# Altium project Autio_Mixer.PrjPcb
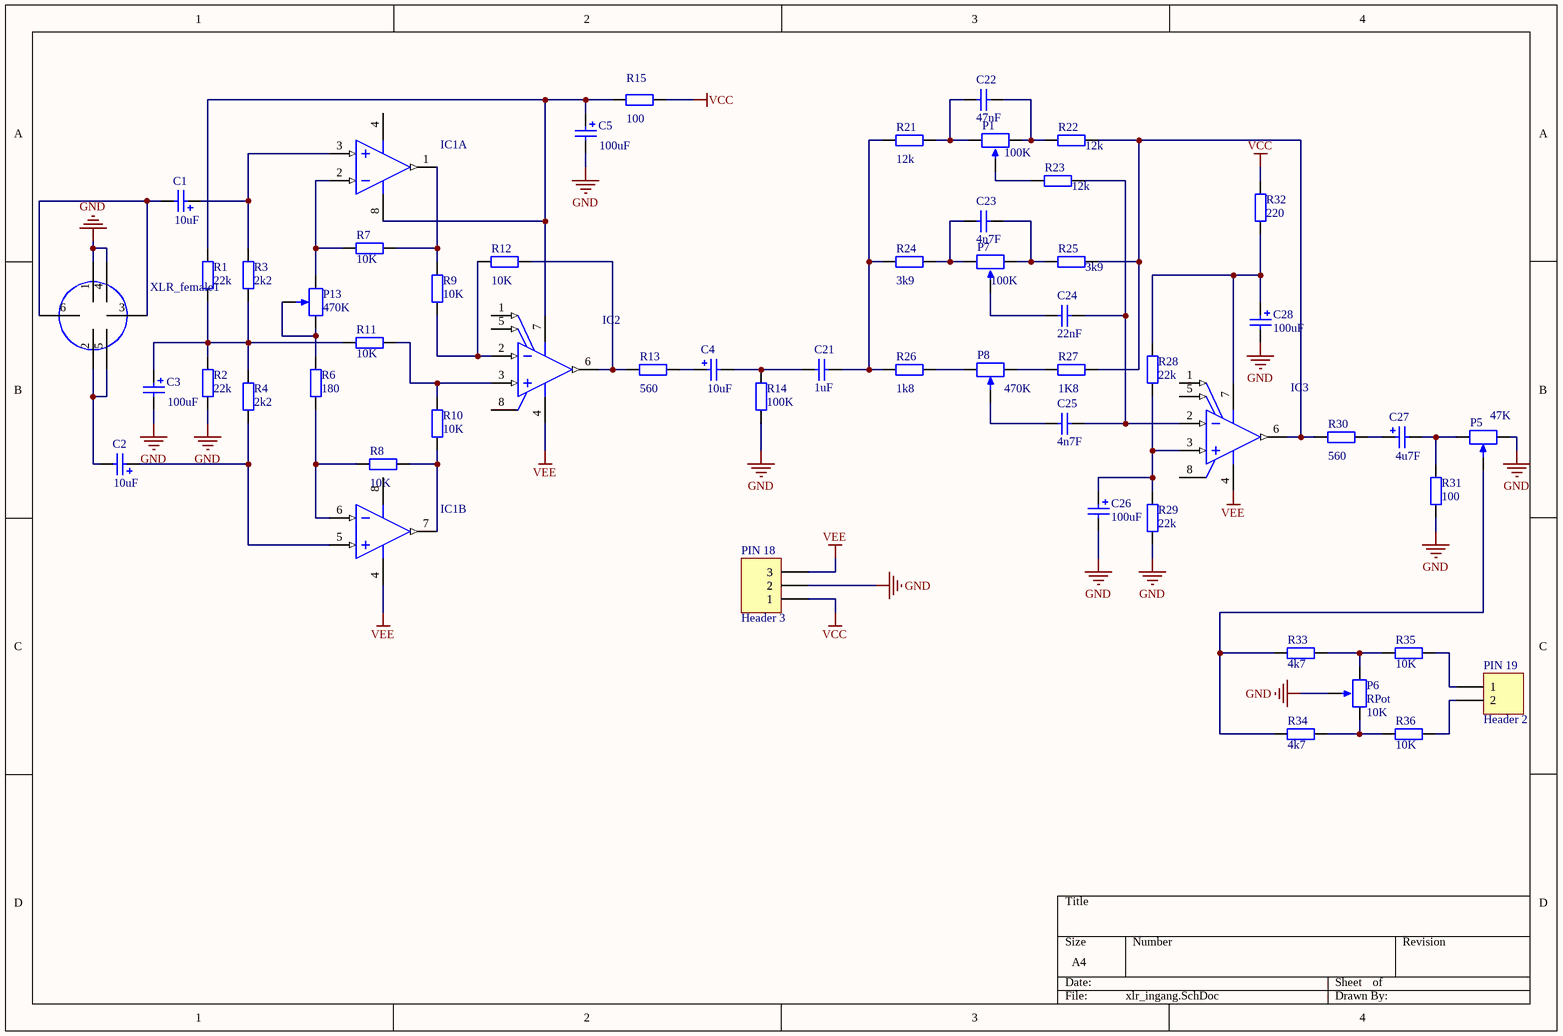
[diagram p0: xlr_ingang.SchDoc]
4 sheets, 242 parts. Net scope: flat (ports and power ports of the same name join across sheets).
Board files: power_sup.PcbDoc, summing_circuit.PcbDoc, cinch_stereo_ingang.PcbDoc, xlr_ingang.PcbDoc, circuit_everything.PcbDoc
Sheets:
  xlr_ingang.SchDoc
  cinch_stereo_ingang.SchDoc
  summing_circuit.SchDoc
  power_SUP.SchDoc

## Sheet xlr_ingang.SchDoc
size A4

### Parts
C1  value 10uF  [Capacitor 10uF]  (hidden comment: Cap Pol2)
C2  value 10uF  [Capacitor 10uF]  (hidden comment: Cap Pol2)
C3  value 100uF  [Capacitor 100uF]  (hidden comment: Cap Pol2)
C4  value 10uF  [Capacitor 10uF]  (hidden comment: Cap Pol2)
C5  value 100uF  [Capacitor 100uF]  (hidden comment: Cap Pol2)
C21  value 1uF  [Capacitor 1uF]  (hidden comment: Cap)
C22  value 47nF  [Capacitor 22nF, 47nF, 100nF]  (hidden comment: Cap)
C23  value 4n7F  [Capacitor 22nF, 47nF, 100nF]  (hidden comment: Cap)
C24  value 22nF  [Capacitor 22nF, 47nF, 100nF]  (hidden comment: Cap)
C25  value 4n7F  [Capacitor 22nF, 47nF, 100nF]  (hidden comment: Cap)
C26  value 100uF  [Capacitor 100uF]  (hidden comment: Cap Pol2)
C27  value 4u7F  [Capacitor 4u7F]  (hidden comment: Cap Pol2)
C28  value 100uF  [Capacitor 100uF]  (hidden comment: Cap Pol2)
IC1  LM833DR2G  [OPAMP_LM833]  (value not drawn)  (parts A,B of 2)
IC2  TL061CD  [OPAMP_TL061]  (value not drawn)
IC3  TL061CD  [OPAMP_TL061]  (value not drawn)
P1  value 100K  [header_3]  (hidden comment: RPot)
P5  value 47K  [header_3]  (hidden comment: RPot)
P6  RPot  value 10K  [header_3]
P7  value 100K  [header_3]  (hidden comment: RPot)
P8  value 470K  [header_3]  (hidden comment: RPot)
P13  value 470K  [header_3]  (hidden comment: RPot)
PIN_18  Header 3  [header_3]
PIN_19  Header 2  [header_2]
R1  value 22k  [C1206]  (hidden comment: Res2)
R2  value 22k  [C1206]  (hidden comment: Res2)
R3  value 2k2  [C1206]  (hidden comment: Res2)
R4  value 2k2  [C1206]  (hidden comment: Res2)
R6  value 180  [C1206]  (hidden comment: Res2)
R7  value 10K  [C1206]  (hidden comment: Res2)
R8  value 10K  [C1206]  (hidden comment: Res2)
R9  value 10K  [C1206]  (hidden comment: Res2)
R10  value 10K  [C1206]  (hidden comment: Res2)
R11  value 10K  [C1206]  (hidden comment: Res2)
R12  value 10K  [C1206]  (hidden comment: Res2)
R13  value 560  [C1206]  (hidden comment: Res2)
R14  value 100K  [C1206]  (hidden comment: Res2)
R15  value 100  [C1206]  (hidden comment: Res2)
R21  value 12k  [C1206]  (hidden comment: Res2)
R22  value 12k  [C1206]  (hidden comment: Res2)
R23  value 12k  [C1206]  (hidden comment: Res2)
R24  value 3k9  [C1206]  (hidden comment: Res2)
R25  value 3k9  [C1206]  (hidden comment: Res2)
R26  value 1k8  [C1206]  (hidden comment: Res2)
R27  value 1K8  [C1206]  (hidden comment: Res2)
R28  value 22k  [C1206]  (hidden comment: Res2)
R29  value 22k  [C1206]  (hidden comment: Res2)
R30  value 560  [C1206]  (hidden comment: Res2)
R31  value 100  [C1206]  (hidden comment: Res2)
R32  value 220  [C1206]  (hidden comment: Res2)
R33  value 4k7  [C1206]  (hidden comment: Res2)
R34  value 4k7  [C1206]  (hidden comment: Res2)
R35  value 10K  [C1206]  (hidden comment: Res2)
R36  value 10K  [C1206]  (hidden comment: Res2)
XLR_female1  XLR_female  [XLR_Femail_Neutrik_NCJ6FA-V]  (value not drawn)

### Nets
GND: C3.2 C5.2 C26.2 C28.2 P5.3(BOT) P6.2(TAP) PIN_18.1(2) R2.1 R14.1 R29.1 R31.1 XLR_female1.1(GND) XLR_female1.4(Sleeve_/_GND)
VCC: PIN_18.2(1) R15.2 R32.2
VEE: IC1.4(VEE) IC2.4(VCC-) IC3.4(VCC-) PIN_18.3
NetC1_1: C1.1 IC1.3(IN1+) R3.2
NetC1_2: C1.2 XLR_female1.3(negative) XLR_female1.6(Tip_/_pos)
NetC2_1: C2.1 IC1.5(IN2+) R4.1
NetC2_2: C2.2 XLR_female1.2(Pos) XLR_female1.5(Ring_/_neg)
NetC3_1: C3.1 R1.1 R2.2 R3.1 R4.2 R11.1
NetC4_1: C4.1 R13.2
NetC4_2: C4.2 C21.1 R14.2
NetC5_1: C5.1 IC1.8(VCC) IC2.7(VCC+) R1.2 R15.1
NetC21_2: C21.2 R21.1 R24.1 R26.1
NetC22_1: C22.1 P1.1(TOP) R21.2
NetC22_2: C22.2 P1.3(BOT) R22.1
NetC23_1: C23.1 P7.1(TOP) R24.2
NetC23_2: C23.2 P7.3(BOT) R25.1
NetC24_1: C24.1 P7.2(TAP)
NetC24_2: C24.2 C25.2 IC3.2(IN-) R23.2
NetC25_1: C25.1 P8.2(TAP)
NetC26_1: C26.1 IC3.3(IN+) R28.1 R29.2
NetC27_1: C27.1 R30.2
NetC27_2: C27.2 P5.1(TOP) R31.2
NetC28_1: C28.1 IC3.7(VCC+) R28.2 R32.1
NetIC1_1: IC1.1(OUT1) R7.2 R9.2
NetIC1_2: IC1.2(IN1-) P13.3(TOP) R7.1
NetIC1_6: IC1.6(IN2-) R6.1 R8.1
NetIC1_7: IC1.7(OUT2) R8.2 R10.1
NetIC2_2: IC2.2(IN-) R9.1 R12.1
NetIC2_3: IC2.3(IN+) R10.2 R11.2
NetIC2_6: IC2.6(OUT) R12.2 R13.1
NetIC3_6: IC3.6(OUT) R22.2 R25.2 R27.2 R30.1
NetP1_2: P1.2(TAP) R23.1
NetP5_2: P5.2(TAP) R33.1 R34.1
NetP6_1: P6.1(TOP) R33.2 R35.1
NetP6_3: P6.3(BOT) R34.2 R36.1
NetP8_1: P8.1(TOP) R26.2
NetP8_3: P8.3(BOT) R27.1
NetP13_1: P13.1(TAP) P13.2(BOT) R6.2
NetPIN_19_1: PIN_19.1(2) R36.2
NetPIN_19_2: PIN_19.2(1) R35.2

Not connected (* = marked no-connect by the designer): IC2 1(OFFSET_N1) 5(OFFSET_N2) 8(NC); IC3 1(OFFSET_N1) 5(OFFSET_N2) 8(NC)

### Library data of the parts
C1-C5 C26-C28 = Cap Pol2: Polarized Capacitor (Axial); Published: 8-Jun-2000; LatestRevisionDate: 17-Jul-2002; LatestRevisionNote: Re-released for DXP Platform.; PackageReference: POLAR0.8; Publisher: Altium Limited; PackageDescription: Polarized Capacitor; 2 Leads
C21-C25 = Cap: Capacitor; Published: 8-Jun-2000; LatestRevisionDate: 17-Jul-2002; LatestRevisionNote: Re-released for DXP Platform.; PackageReference: RAD-0.3; Publisher: Altium Limited; PackageDescription: Radial Cap, Thru-Hole; 2 Leads; 0.3 in Pin Spacing
IC1 = opamp_LM833: Low Noise, Audio Dual Operational Amplifier, -40 to 85 degC, 8-Pin SOIC, Pb-Free, Tape and Reel; Manufacturer: On Semiconductor; GBW Typ (MHz): 15; SR Typ (V/uS): 7; PackageReference: SOIC-8-751-07; ComponentLink3URL: http://www.onsemi.com/pub_link/Collateral/751-07.PDF; ComponentLink2URL: http://www.onsemi.cn/pub_link/Collateral/LM833-D.PDF; PackageVersion: Rev. AK, 02/2011; ComponentLink2Description: Datasheet; Mounting Technology: Surface Mount; Packing: Tape and Reel; PackageDescription: 8-Pin Small Outline Integrated Circuit, Body 4.9 x 3.9 mm, Pitch 1.27 mm; RoHS: TRUE; ComponentLink3Description: Package Specification; DatasheetVersion: Rev. 6; ComponentLink1URL: http://www.onsemi.com/; PartNumber: LM833DR2G; ComponentLink1Description: Manufacturer URL
IC2 = opamp_L061: Low-Power JFET-Input General-Purpose Operational Amplifier, 7 to 36 V, 0 to 70 degC, 8-pin SOIC (D8), Green (RoHS & no Sb/Br); Manufacturer: Texas Instruments; Sub Family: General Purpose Amplifier, High Supply Voltage Amplifier (>=30V), Low Power Amp (<=500uA); Iq per channel(Max)(mA): 0.25; CMRR(Min)(dB): 70; IIB(Max)(pA): 400; Slew Rate(Typ)(V/us): 3.5; Number of Channels: 1; Total Supply Voltage(Max)(+5V is 5, +/-5V is 10): 36; Vn at 1kHz(Typ)(nV/rtHz): 42; Vio (25C)(Max)(mV): 15; Rating: Military; Offset Drift(Typ)(uV/C): 10; Total Supply Voltage(Min)(+5V is 5, +/-5V is 10): 7; Eco-Plan: Green (RoHS & no Sb/Br); ComponentLink2Description: Datasheet; PackageReference: D0008A; ComponentLink3Description: Package Specification; ComponentLink2URL: http://www.ti.com/lit/ds/symlink/tl061.pdf; Mounting Technology: Surface Mount; ComponentLink1Description: Manufacturer URL; PackageDescription: 8-Pin Plastic Small Outline, Body 4.9 x 3.9 mm, Pitch 1.27 mm; DatasheetVersion: SLOS078J; PartNumber: TL061CD; Code_JEDEC: MS-012; GBW(Typ)(MHz): 1; ComponentLink3URL: http://www.ti.com/litv/pdf/msoi002j; ComponentLink1URL: http://www.ti.com/; PackageVersion: 4040047-3/M, 06/2011
IC3 = opamp_TL061: Low-Power JFET-Input General-Purpose Operational Amplifier, 7 to 36 V, 0 to 70 degC, 8-pin SOIC (D8), Green (RoHS & no Sb/Br); Manufacturer: Texas Instruments; Sub Family: General Purpose Amplifier, High Supply Voltage Amplifier (>=30V), Low Power Amp (<=500uA); Iq per channel(Max)(mA): 0.25; CMRR(Min)(dB): 70; IIB(Max)(pA): 400; Slew Rate(Typ)(V/us): 3.5; Number of Channels: 1; Total Supply Voltage(Max)(+5V is 5, +/-5V is 10): 36; Vn at 1kHz(Typ)(nV/rtHz): 42; Vio (25C)(Max)(mV): 15; Rating: Military; Offset Drift(Typ)(uV/C): 10; Total Supply Voltage(Min)(+5V is 5, +/-5V is 10): 7; Eco-Plan: Green (RoHS & no Sb/Br); ComponentLink2Description: Datasheet; PackageReference: D0008A; ComponentLink3Description: Package Specification; ComponentLink2URL: http://www.ti.com/lit/ds/symlink/tl061.pdf; Mounting Technology: Surface Mount; ComponentLink1Description: Manufacturer URL; PackageDescription: 8-Pin Plastic Small Outline, Body 4.9 x 3.9 mm, Pitch 1.27 mm; DatasheetVersion: SLOS078J; PartNumber: TL061CD; Code_JEDEC: MS-012; GBW(Typ)(MHz): 1; ComponentLink3URL: http://www.ti.com/litv/pdf/msoi002j; ComponentLink1URL: http://www.ti.com/; PackageVersion: 4040047-3/M, 06/2011
P1 P6 P7 = RPot: Potentiometer; Sim Note: Enter the Resistance value and the set point into parameter fields.; Set Position: 0.5; Published: 8-Jun-2000; LatestRevisionDate: 17-Jul-2002; LatestRevisionNote: Re-released for DXP Platform.; PackageReference: VR5; Publisher: Altium Limited; PackageDescription: Variable Resistor, Thru-Hole; 3 Leads
P5 P8 P13 = RPot_1: Potentiometer; Sim Note: Enter the Resistance value and the set point into parameter fields.; Set Position: 0.5; Published: 8-Jun-2000; LatestRevisionDate: 17-Jul-2002; LatestRevisionNote: Re-released for DXP Platform.; PackageReference: VR5; Publisher: Altium Limited; PackageDescription: Variable Resistor, Thru-Hole; 3 Leads
PIN_18 = Header 3: Header, 3-Pin; LatestRevisionDate: 17-Jul-2002; LatestRevisionNote: Re-released for DXP Platform.; Publisher: Altium Limited
PIN_19 = Header 2: Header, 2-Pin; LatestRevisionDate: 17-Jul-2002; LatestRevisionNote: Re-released for DXP Platform.; Publisher: Altium Limited
R1-R4 R6-R15 R21-R32 = Res2: Resistor; Published: 8-Jun-2000; LatestRevisionDate: 17-Jul-2002; LatestRevisionNote: Re-released for DXP Platform.; PackageReference: AXIAL-0.4; Publisher: Altium Limited; PackageDescription: Axial Device, Thru-Hole; 2 Leads; 0.4 in Pin Spacing
R33 R34 = Res2_13: Resistor; Published: 8-Jun-2000; LatestRevisionDate: 17-Jul-2002; LatestRevisionNote: Re-released for DXP Platform.; PackageReference: AXIAL-0.4; Publisher: Altium Limited; PackageDescription: Axial Device, Thru-Hole; 2 Leads; 0.4 in Pin Spacing
R35 R36 = Res2_3: Resistor; Published: 8-Jun-2000; LatestRevisionDate: 17-Jul-2002; LatestRevisionNote: Re-released for DXP Platform.; PackageReference: AXIAL-0.4; Publisher: Altium Limited; PackageDescription: Axial Device, Thru-Hole; 2 Leads; 0.4 in Pin Spacing

## Sheet cinch_stereo_ingang.SchDoc
size A4
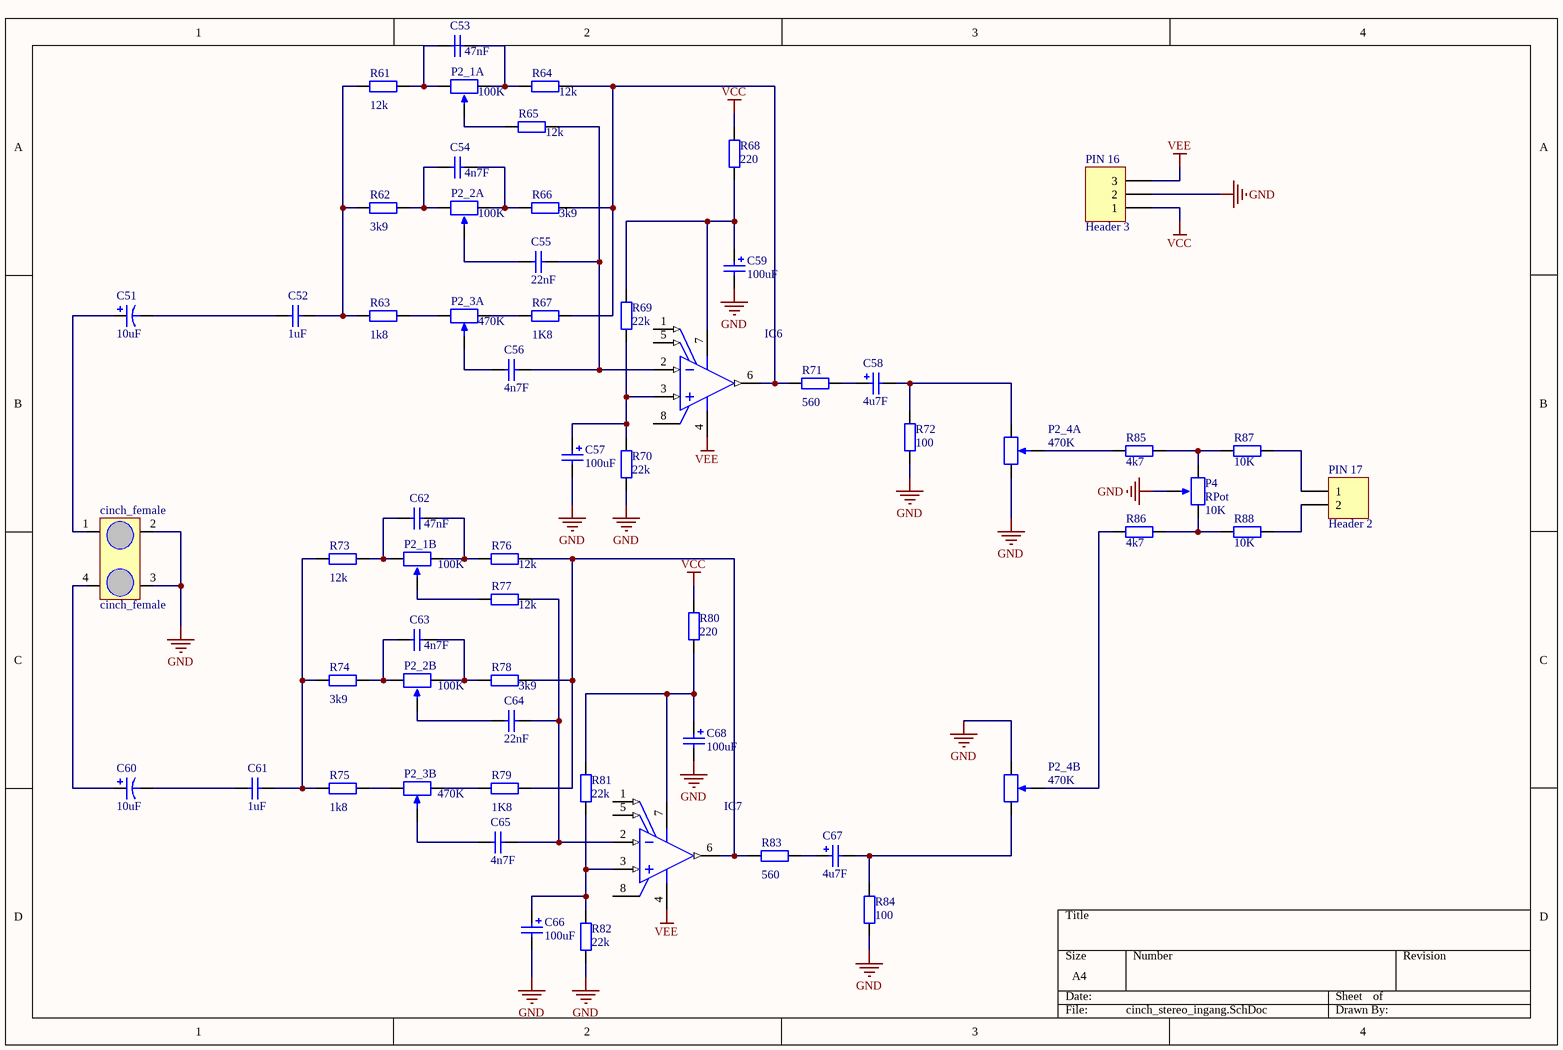
[diagram p1: cinch_stereo_ingang.SchDoc]

### Parts
C51  value 10uF  [Capacitor 10uF]  (hidden comment: Cap Pol2)
C52  value 1uF  [Capacitor 1uF]  (hidden comment: Cap)
C53  value 47nF  [Capacitor 22nF, 47nF, 100nF]  (hidden comment: Cap)
C54  value 4n7F  [Capacitor 22nF, 47nF, 100nF]  (hidden comment: Cap)
C55  value 22nF  [Capacitor 22nF, 47nF, 100nF]  (hidden comment: Cap)
C56  value 4n7F  [Capacitor 22nF, 47nF, 100nF]  (hidden comment: Cap)
C57  value 100uF  [Capacitor 100uF]  (hidden comment: Cap Pol2)
C58  value 4u7F  [Capacitor 4u7F]  (hidden comment: Cap Pol2)
C59  value 100uF  [Capacitor 100uF]  (hidden comment: Cap Pol2)
C60  value 10uF  [Capacitor 10uF]  (hidden comment: Cap Pol2)
C61  value 1uF  [Capacitor 1uF]  (hidden comment: Cap)
C62  value 47nF  [Capacitor 22nF, 47nF, 100nF]  (hidden comment: Cap)
C63  value 4n7F  [Capacitor 22nF, 47nF, 100nF]  (hidden comment: Cap)
C64  value 22nF  [Capacitor 22nF, 47nF, 100nF]  (hidden comment: Cap)
C65  value 4n7F  [Capacitor 22nF, 47nF, 100nF]  (hidden comment: Cap)
C66  value 100uF  [Capacitor 100uF]  (hidden comment: Cap Pol2)
C67  value 4u7F  [Capacitor 4u7F]  (hidden comment: Cap Pol2)
C68  value 100uF  [Capacitor 100uF]  (hidden comment: Cap Pol2)
cinch_female  cinch_female  [header_4]
IC6  TL061CD  [OPAMP_TL061]  (value not drawn)
IC7  TL061CD  [OPAMP_TL061]  (value not drawn)
P2_1A  value 100K  [header_3]  (hidden comment: RPot)
P2_1B  value 100K  [header_3]  (hidden comment: RPot)
P2_2A  value 100K  [header_3]  (hidden comment: RPot)
P2_2B  value 100K  [header_3]  (hidden comment: RPot)
P2_3A  value 470K  [header_3]  (hidden comment: RPot)
P2_3B  value 470K  [header_3]  (hidden comment: RPot)
P2_4A  value 470K  [header_3]  (hidden comment: RPot)
P2_4B  value 470K  [header_3]  (hidden comment: RPot)
P4  RPot  value 10K  [header_3]
PIN_16  Header 3  [header_3]
PIN_17  Header 2  [header_2]
R61  value 12k  [C1206]  (hidden comment: Res2)
R62  value 3k9  [C1206]  (hidden comment: Res2)
R63  value 1k8  [C1206]  (hidden comment: Res2)
R64  value 12k  [C1206]  (hidden comment: Res2)
R65  value 12k  [C1206]  (hidden comment: Res2)
R66  value 3k9  [C1206]  (hidden comment: Res2)
R67  value 1K8  [C1206]  (hidden comment: Res2)
R68  value 220  [C1206]  (hidden comment: Res2)
R69  value 22k  [C1206]  (hidden comment: Res2)
R70  value 22k  [C1206]  (hidden comment: Res2)
R71  value 560  [C1206]  (hidden comment: Res2)
R72  value 100  [C1206]  (hidden comment: Res2)
R73  value 12k  [C1206]  (hidden comment: Res2)
R74  value 3k9  [C1206]  (hidden comment: Res2)
R75  value 1k8  [C1206]  (hidden comment: Res2)
R76  value 12k  [C1206]  (hidden comment: Res2)
R77  value 12k  [C1206]  (hidden comment: Res2)
R78  value 3k9  [C1206]  (hidden comment: Res2)
R79  value 1K8  [C1206]  (hidden comment: Res2)
R80  value 220  [C1206]  (hidden comment: Res2)
R81  value 22k  [C1206]  (hidden comment: Res2)
R82  value 22k  [C1206]  (hidden comment: Res2)
R83  value 560  [C1206]  (hidden comment: Res2)
R84  value 100  [C1206]  (hidden comment: Res2)
R85  value 4k7  [C1206]  (hidden comment: Res2)
R86  value 4k7  [C1206]  (hidden comment: Res2)
R87  value 10K  [C1206]  (hidden comment: Res2)
R88  value 10K  [C1206]  (hidden comment: Res2)

### Nets
GND: C57.2 C59.2 C66.2 C68.2 cinch_female.2(GND_left) cinch_female.3(GND_right) P2_4A.3(TOP) P2_4B.3(BOT) P4.3(TAP) PIN_16.3(2) R70.1 R72.1 R82.1 R84.1
VCC: PIN_16.2(1) R68.2 R80.2
VEE: IC6.4(VCC-) IC7.4(VCC-) PIN_16.1(3)
NetC51_1: C51.1 cinch_female.1(Left_red)
NetC51_2: C51.2 C52.1
NetC52_2: C52.2 R61.1 R62.1 R63.1
NetC53_1: C53.1 P2_1A.1(TOP) R61.2
NetC53_2: C53.2 P2_1A.3(BOT) R64.1
NetC54_1: C54.1 P2_2A.1(TOP) R62.2
NetC54_2: C54.2 P2_2A.3(BOT) R66.1
NetC55_1: C55.1 P2_2A.2(TAP)
NetC55_2: C55.2 C56.2 IC6.2(IN-) R65.2
NetC56_1: C56.1 P2_3A.2(TAP)
NetC57_1: C57.1 IC6.3(IN+) R69.1 R70.2
NetC58_1: C58.1 R71.2
NetC58_2: C58.2 P2_4A.1(BOT) R72.2
NetC59_1: C59.1 IC6.7(VCC+) R68.1 R69.2
NetC60_1: C60.1 cinch_female.4(Right_Black/White)
NetC60_2: C60.2 C61.1
NetC61_2: C61.2 R73.1 R74.1 R75.1
NetC62_1: C62.1 P2_1B.1(TOP) R73.2
NetC62_2: C62.2 P2_1B.3(BOT) R76.1
NetC63_1: C63.1 P2_2B.1(TOP) R74.2
NetC63_2: C63.2 P2_2B.3(BOT) R78.1
NetC64_1: C64.1 P2_2B.2(TAP)
NetC64_2: C64.2 C65.2 IC7.2(IN-) R77.2
NetC65_1: C65.1 P2_3B.2(TAP)
NetC66_1: C66.1 IC7.3(IN+) R81.1 R82.2
NetC67_1: C67.1 R83.2
NetC67_2: C67.2 P2_4B.1(TOP) R84.2
NetC68_1: C68.1 IC7.7(VCC+) R80.1 R81.2
NetIC6_6: IC6.6(OUT) R64.2 R66.2 R67.2 R71.1
NetIC7_6: IC7.6(OUT) R76.2 R78.2 R79.2 R83.1
NetP2_1A_2: P2_1A.2(TAP) R65.1
NetP2_1B_2: P2_1B.2(TAP) R77.1
NetP2_3A_1: P2_3A.1(TOP) R63.2
NetP2_3A_3: P2_3A.3(BOT) R67.1
NetP2_3B_1: P2_3B.1(TOP) R75.2
NetP2_3B_3: P2_3B.3(BOT) R79.1
NetP2_4A_2: P2_4A.2(TAP) R85.1
NetP2_4B_2: P2_4B.2(TAP) R86.1
NetP4_1: P4.1(BOT) R86.2 R88.1
NetP4_2: P4.2(TOP) R85.2 R87.1
NetPIN_17_1: PIN_17.1 R87.2
NetPIN_17_2: PIN_17.2 R88.2

Not connected (* = marked no-connect by the designer): IC6 1(OFFSET_N1) 5(OFFSET_N2) 8(NC); IC7 1(OFFSET_N1) 5(OFFSET_N2) 8(NC)

### Library data of the parts
C51 C57-C60 C66-C68 = Cap Pol2: electrolytic; Published: 8-Jun-2000; LatestRevisionDate: 17-Jul-2002; LatestRevisionNote: Re-released for DXP Platform.; PackageReference: POLAR0.8; Publisher: Altium Limited; PackageDescription: Polarized Capacitor; 2 Leads
C52-C56 C61-C65 = Cap: Capacitor; Published: 8-Jun-2000; LatestRevisionDate: 17-Jul-2002; LatestRevisionNote: Re-released for DXP Platform.; PackageReference: RAD-0.3; Publisher: Altium Limited; PackageDescription: Radial Cap, Thru-Hole; 2 Leads; 0.3 in Pin Spacing
IC6 IC7 = opamp_TL061: as IC3 on sheet xlr_ingang; Eco-Plan: Green (RoHS & no Sb/Br); ComponentLink2Description: Datasheet; PackageReference: D0008A; ComponentLink3Description: Package Specification; ComponentLink2URL: http://www.ti.com/lit/ds/symlink/tl061.pdf; Mounting Technology: Surface Mount; ComponentLink1Description: Manufacturer URL; PackageDescription: 8-Pin Plastic Small Outline, Body 4.9 x 3.9 mm, Pitch 1.27 mm; DatasheetVersion: SLOS078J; PartNumber: TL061CD; Code_JEDEC: MS-012; GBW(Typ)(MHz): 1; ComponentLink3URL: http://www.ti.com/litv/pdf/msoi002j; ComponentLink1URL: http://www.ti.com/; PackageVersion: 4040047-3/M, 06/2011
P2_1A P2_1B P2_2A P2_2B P4 = RPot: as P1 on sheet xlr_ingang; Published: 8-Jun-2000; LatestRevisionDate: 17-Jul-2002; LatestRevisionNote: Re-released for DXP Platform.; PackageReference: VR5; Publisher: Altium Limited; PackageDescription: Variable Resistor, Thru-Hole; 3 Leads
P2_3A P2_3B P2_4A P2_4B = RPot_1: as P5 on sheet xlr_ingang; Published: 8-Jun-2000; LatestRevisionDate: 17-Jul-2002; LatestRevisionNote: Re-released for DXP Platform.; PackageReference: VR5; Publisher: Altium Limited; PackageDescription: Variable Resistor, Thru-Hole; 3 Leads
PIN_16 = Header 3: Header, 3-Pin; LatestRevisionDate: 17-Jul-2002; LatestRevisionNote: Re-released for DXP Platform.; Publisher: Altium Limited
PIN_17 = Header 2: Header, 2-Pin; LatestRevisionDate: 17-Jul-2002; LatestRevisionNote: Re-released for DXP Platform.; Publisher: Altium Limited
R61-R84 = Res2: Resistor; Published: 8-Jun-2000; LatestRevisionDate: 17-Jul-2002; LatestRevisionNote: Re-released for DXP Platform.; PackageReference: AXIAL-0.4; Publisher: Altium Limited; PackageDescription: Axial Device, Thru-Hole; 2 Leads; 0.4 in Pin Spacing
R85 R86 = Res2_13: Resistor; Published: 8-Jun-2000; LatestRevisionDate: 17-Jul-2002; LatestRevisionNote: Re-released for DXP Platform.; PackageReference: AXIAL-0.4; Publisher: Altium Limited; PackageDescription: Axial Device, Thru-Hole; 2 Leads; 0.4 in Pin Spacing
R87 R88 = Res2_3: Resistor; Published: 8-Jun-2000; LatestRevisionDate: 17-Jul-2002; LatestRevisionNote: Re-released for DXP Platform.; PackageReference: AXIAL-0.4; Publisher: Altium Limited; PackageDescription: Axial Device, Thru-Hole; 2 Leads; 0.4 in Pin Spacing

## Sheet summing_circuit.SchDoc
size A4
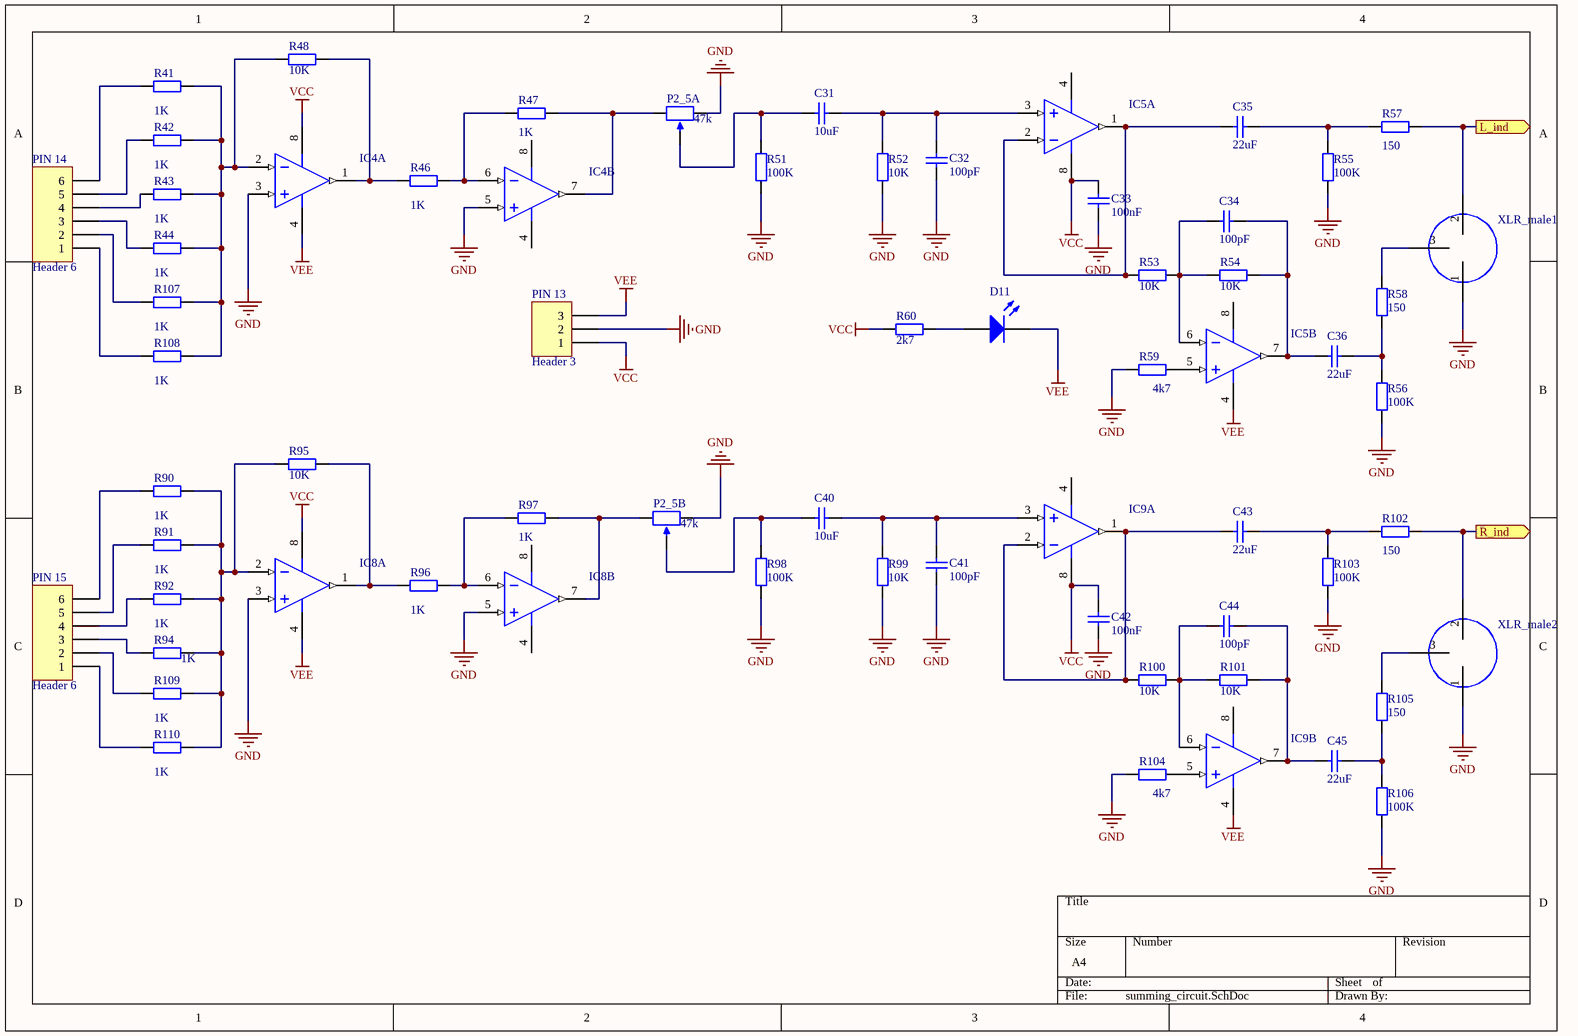
[diagram p2: summing_circuit.SchDoc]

### Parts
C31  value 10uF  [Capacitor 10uF]  (hidden comment: Cap)
C32  value 100pF  [Capacitor 100pF]  (hidden comment: Cap)
C33  value 100nF  [Capacitor 22nF, 47nF, 100nF]  (hidden comment: Cap)
C34  value 100pF  [Capacitor 100pF]  (hidden comment: Cap)
C35  value 22uF  [Capacitor 100uF]  (hidden comment: Cap)
C36  value 22uF  [Capacitor 100uF]  (hidden comment: Cap)
C40  value 10uF  [Capacitor 10uF]  (hidden comment: Cap)
C41  value 100pF  [Capacitor 100pF]  (hidden comment: Cap)
C42  value 100nF  [Capacitor 22nF, 47nF, 100nF]  (hidden comment: Cap)
C43  value 22uF  [Capacitor 100pF]  (hidden comment: Cap)
C44  value 100pF  [Capacitor 100uF]  (hidden comment: Cap)
C45  value 22uF  [Capacitor 100uF]  (hidden comment: Cap)
D11  LED1  [LED]  (value not drawn)
IC4  LM833DR2G  [OPAMP_LM833]  (value not drawn)  (parts A,B of 2)
IC5  LM833DR2G  [OPAMP_LM833]  (value not drawn)  (parts A,B of 2)
IC8  LM833DR2G  [OPAMP_LM833]  (value not drawn)  (parts A,B of 2)
IC9  LM833DR2G  [OPAMP_LM833]  (value not drawn)  (parts A,B of 2)
P2_5A  value 47k  [header_3]  (hidden comment: RPot)
P2_5B  value 47k  [header_3]  (hidden comment: RPot)
PIN_13  Header 3  [header_3]
PIN_14  Header 6  [header_6]
PIN_15  Header 6  [header_6]
R41  value 1K  [C1206]  (hidden comment: Res2)
R42  value 1K  [C1206]  (hidden comment: Res2)
R43  value 1K  [C1206]  (hidden comment: Res2)
R44  value 1K  [C1206]  (hidden comment: Res2)
R46  value 1K  [C1206]  (hidden comment: Res2)
R47  value 1K  [C1206]  (hidden comment: Res2)
R48  value 10K  [C1206]  (hidden comment: Res2)
R51  value 100K  [C1206]  (hidden comment: Res2)
R52  value 10K  [C1206]  (hidden comment: Res2)
R53  value 10K  [C1206]  (hidden comment: Res2)
R54  value 10K  [C1206]  (hidden comment: Res2)
R55  value 100K  [C1206]  (hidden comment: Res2)
R56  value 100K  [C1206]  (hidden comment: Res2)
R57  value 150  [C1206]  (hidden comment: Res2)
R58  value 150  [C1206]  (hidden comment: Res2)
R59  value 4k7  [C1206]  (hidden comment: Res2)
R60  value 2k7  [C1206]  (hidden comment: Res2)
R90  value 1K  [C1206]  (hidden comment: Res2)
R91  value 1K  [C1206]  (hidden comment: Res2)
R92  value 1K  [C1206]  (hidden comment: Res2)
R94  value 1K  [C1206]  (hidden comment: Res2)
R95  value 10K  [C1206]  (hidden comment: Res2)
R96  value 1K  [C1206]  (hidden comment: Res2)
R97  value 1K  [C1206]  (hidden comment: Res2)
R98  value 100K  [C1206]  (hidden comment: Res2)
R99  value 10K  [C1206]  (hidden comment: Res2)
R100  value 10K  [C1206]  (hidden comment: Res2)
R101  value 10K  [C1206]  (hidden comment: Res2)
R102  value 150  [C1206]  (hidden comment: Res2)
R103  value 100K  [C1206]  (hidden comment: Res2)
R104  value 4k7  [C1206]  (hidden comment: Res2)
R105  value 150  [C1206]  (hidden comment: Res2)
R106  value 100K  [C1206]  (hidden comment: Res2)
R107  value 1K  [C1206]  (hidden comment: Res2)
R108  value 1K  [C1206]  (hidden comment: Res2)
R109  value 1K  [C1206]  (hidden comment: Res2)
R110  value 1K  [C1206]  (hidden comment: Res2)
XLR_male1  XLR_male  [XLR_MALE_Neutrik_NC3_MAV]  (value not drawn)
XLR_male2  XLR_male  [XLR_MALE_Neutrik_NC3_MAV]  (value not drawn)

### Ports
L_ind (out), R_ind (out)

### Nets
GND: C32.1 C33.1 C41.1 C42.1 IC4.3(IN1+) IC4.5(IN2+) IC8.3(IN1+) IC8.5(IN2+) P2_5A.3(BOT) P2_5B.3(BOT) PIN_13.1(2) R51.1 R52.1 R55.1 R56.1 R59.1 R98.1 R99.1 R103.1 R104.1 R106.1 XLR_male1.1(GND) XLR_male2.1(GND)
VCC: C33.2 C42.2 IC4.8(VCC) IC5.8(VCC) IC8.8(VCC) IC9.8(VCC) PIN_13.2(1) R60.1
VEE: D11.2(K) IC4.4(VEE) IC5.4(VEE) IC8.4(VEE) IC9.4(VEE) PIN_13.3
NetC31_1: C31.1 P2_5A.2(TAP) R51.2
NetC31_2: C31.2 C32.2 IC5.3(IN1+) R52.2
NetC34_1: C34.1 IC5.6(IN2-) R53.2 R54.1
NetC34_2: C34.2 C36.1 IC5.7(OUT2) R54.2
NetC35_1: C35.1 IC5.1(OUT1) IC5.2(IN1-) R53.1
NetC35_2: C35.2 R55.2 R57.1
NetC36_2: C36.2 R56.2 R58.1
NetC40_1: C40.1 P2_5B.2(TAP) R98.2
NetC40_2: C40.2 C41.2 IC9.3(IN1+) R99.2
NetC43_1: C43.1 IC9.1(OUT1) IC9.2(IN1-) R100.1
NetC43_2: C43.2 R102.1 R103.2
NetC44_1: C44.1 IC9.6(IN2-) R100.2 R101.1
NetC44_2: C44.2 C45.1 IC9.7(OUT2) R101.2
NetC45_2: C45.2 R105.1 R106.2
NetD5_1: R102.2 XLR_male2.2(Pos) ; port R_ind
NetD11_1: D11.1(A) R60.2
NetD12_2: R57.2 XLR_male1.2(Pos) ; port L_ind
NetIC4_1: IC4.1(OUT1) R46.1 R48.2
NetIC4_2: IC4.2(IN1-) R41.2 R42.2 R43.2 R44.2 R48.1 R107.2 R108.2
NetIC4_6: IC4.6(IN2-) R46.2 R47.1
NetIC4_7: IC4.7(OUT2) P2_5A.1(TOP) R47.2
NetIC5_5: IC5.5(IN2+) R59.2
NetIC8_1: IC8.1(OUT1) R95.2 R96.1
NetIC8_2: IC8.2(IN1-) R90.2 R91.2 R92.2 R94.2 R95.1 R109.2 R110.2
NetIC8_6: IC8.6(IN2-) R96.2 R97.1
NetIC8_7: IC8.7(OUT2) P2_5B.1(TOP) R97.2
NetIC9_5: IC9.5(IN2+) R104.2
NetPIN_14_1: PIN_14.1(2) R107.1
NetPIN_14_2: PIN_14.2(1) R108.1
NetPIN_14_3: PIN_14.3 R44.1
NetPIN_14_4: PIN_14.4 R43.1
NetPIN_14_5: PIN_14.5 R42.1
NetPIN_14_6: PIN_14.6 R41.1
NetPIN_15_1: PIN_15.1(2) R109.1
NetPIN_15_2: PIN_15.2(1) R110.1
NetPIN_15_3: PIN_15.3 R94.1
NetPIN_15_4: PIN_15.4 R92.1
NetPIN_15_5: PIN_15.5 R91.1
NetPIN_15_6: PIN_15.6 R90.1
NetR58_2: R58.2 XLR_male1.3(negative)
NetR105_2: R105.2 XLR_male2.3(negative)

### Library data of the parts
C31 C32 C34 C35 C40 C41 C43 C44 = Cap: Capacitor; Published: 8-Jun-2000; LatestRevisionDate: 17-Jul-2002; LatestRevisionNote: Re-released for DXP Platform.; PackageReference: RAD-0.3; Publisher: Altium Limited; PackageDescription: Radial Cap, Thru-Hole; 2 Leads; 0.3 in Pin Spacing
C33 C42 = Cap_3: Capacitor; Published: 8-Jun-2000; LatestRevisionDate: 17-Jul-2002; LatestRevisionNote: Re-released for DXP Platform.; PackageReference: RAD-0.3; Publisher: Altium Limited; PackageDescription: Radial Cap, Thru-Hole; 2 Leads; 0.3 in Pin Spacing
C36 C45 = Cap_5: Capacitor; Published: 8-Jun-2000; LatestRevisionDate: 17-Jul-2002; LatestRevisionNote: Re-released for DXP Platform.; PackageReference: RAD-0.3; Publisher: Altium Limited; PackageDescription: Radial Cap, Thru-Hole; 2 Leads; 0.3 in Pin Spacing
D11 = LED1: Typical RED GaAs LED; Published: 8-Jun-2000; LatestRevisionDate: 08-Jul-2005; LatestRevisionNote: Mech Layer 1 removed.; PackageReference: LED-1; Publisher: Altium Limited; PackageDescription: LED; 2 Leads
IC4 IC5 IC8 IC9 = opamp_LM833: as IC1 on sheet xlr_ingang; PackageReference: SOIC-8-751-07; ComponentLink3URL: http://www.onsemi.com/pub_link/Collateral/751-07.PDF; ComponentLink2URL: http://www.onsemi.cn/pub_link/Collateral/LM833-D.PDF; PackageVersion: Rev. AK, 02/2011; ComponentLink2Description: Datasheet; Mounting Technology: Surface Mount; Packing: Tape and Reel; PackageDescription: 8-Pin Small Outline Integrated Circuit, Body 4.9 x 3.9 mm, Pitch 1.27 mm; RoHS: TRUE; ComponentLink3Description: Package Specification; DatasheetVersion: Rev. 6; ComponentLink1URL: http://www.onsemi.com/; PartNumber: LM833DR2G; ComponentLink1Description: Manufacturer URL
P2_5A P2_5B = RPot: as P1 on sheet xlr_ingang; Published: 8-Jun-2000; LatestRevisionDate: 17-Jul-2002; LatestRevisionNote: Re-released for DXP Platform.; PackageReference: VR5; Publisher: Altium Limited; PackageDescription: Variable Resistor, Thru-Hole; 3 Leads
PIN_13 = Header 3: Header, 3-Pin; LatestRevisionDate: 17-Jul-2002; LatestRevisionNote: Re-released for DXP Platform.; Publisher: Altium Limited
PIN_14 PIN_15 = Header 6: Header, 6-Pin; LatestRevisionDate: 17-Jul-2002; LatestRevisionNote: Re-released for DXP Platform.; Publisher: Altium Limited
R41-R44 R46 R47 R57-R59 R90-R92 R94 R96 R97 R102 R104 R105 R107-R110 = Res2: Resistor; Published: 8-Jun-2000; LatestRevisionDate: 17-Jul-2002; LatestRevisionNote: Re-released for DXP Platform.; PackageReference: AXIAL-0.4; Publisher: Altium Limited; PackageDescription: Axial Device, Thru-Hole; 2 Leads; 0.4 in Pin Spacing
R48 R52-R54 R95 R99-R101 = Res2_3: Resistor; Published: 8-Jun-2000; LatestRevisionDate: 17-Jul-2002; LatestRevisionNote: Re-released for DXP Platform.; PackageReference: AXIAL-0.4; Publisher: Altium Limited; PackageDescription: Axial Device, Thru-Hole; 2 Leads; 0.4 in Pin Spacing
R51 R55 R56 R98 R103 R106 = Res2_5: Resistor; Published: 8-Jun-2000; LatestRevisionDate: 17-Jul-2002; LatestRevisionNote: Re-released for DXP Platform.; PackageReference: AXIAL-0.4; Publisher: Altium Limited; PackageDescription: Axial Device, Thru-Hole; 2 Leads; 0.4 in Pin Spacing
R60 = Res_16: Resistor; Published: 8-Jun-2000; LatestRevisionDate: 17-Jul-2002; LatestRevisionNote: Re-released for DXP Platform.; PackageReference: AXIAL-0.4; Publisher: Altium Limited; PackageDescription: Axial Device, Thru-Hole; 2 Leads; 0.4 in Pin Spacing

## Sheet power_SUP.SchDoc
size A4
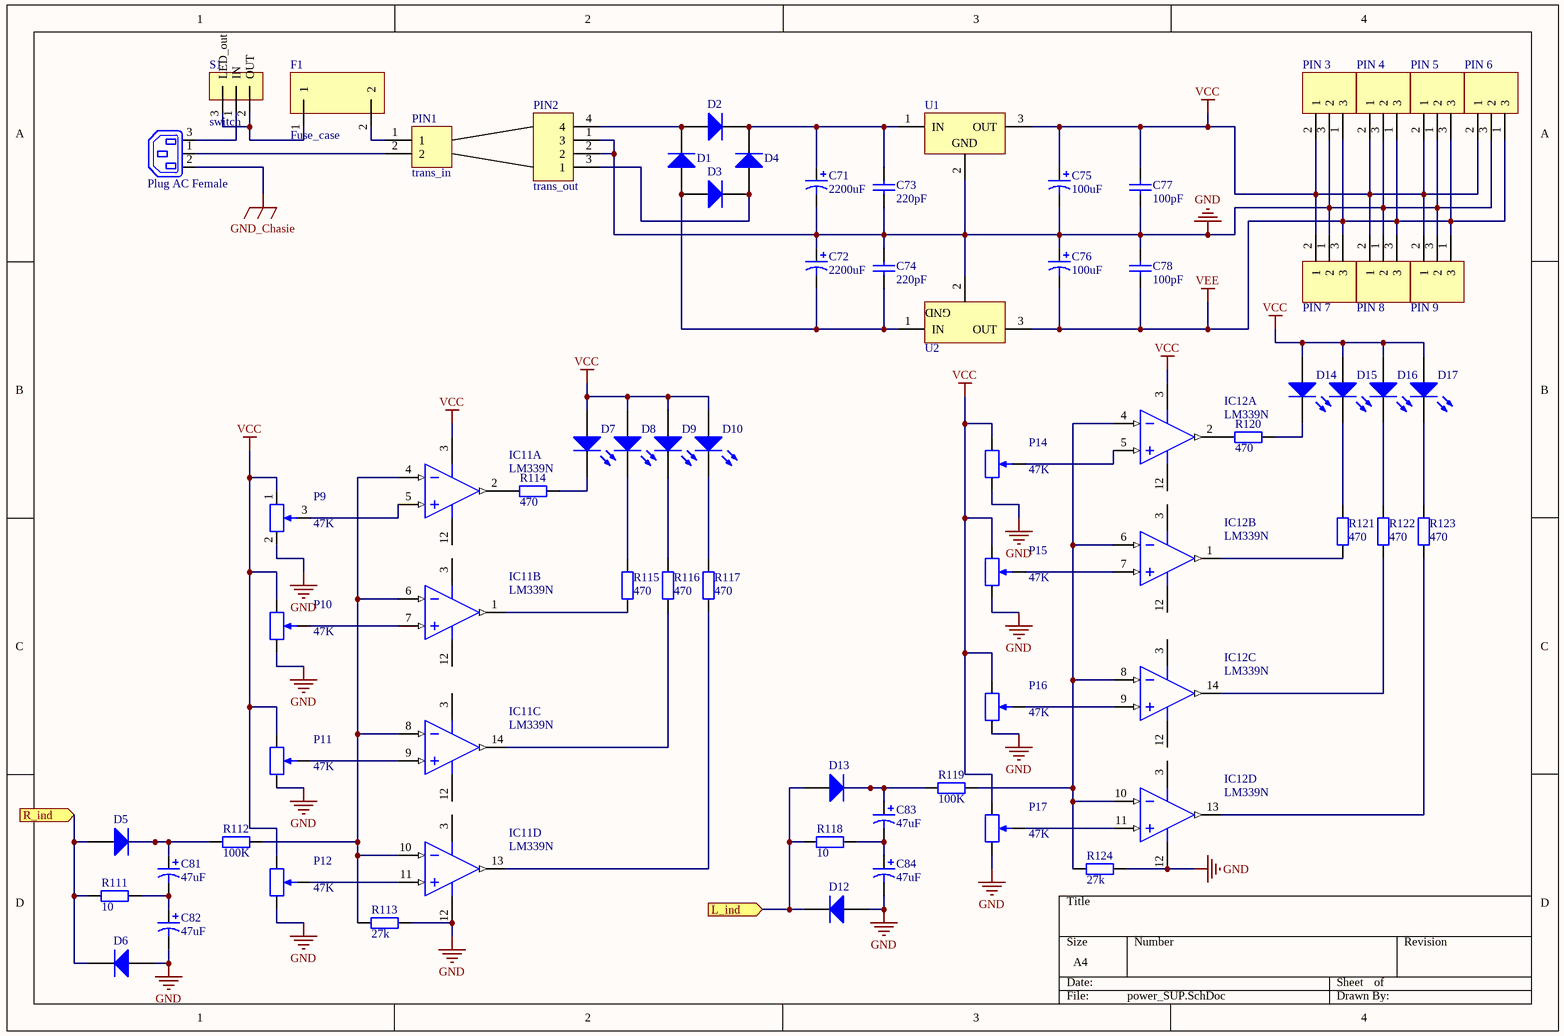
[diagram p3: power_SUP.SchDoc]

### Parts
C71  value 2200uF  [capacitor 2200uF]  (hidden comment: Cap Pol2)
C72  value 2200uF  [capacitor 2200uF]  (hidden comment: Cap Pol2)
C73  value 220pF  [220PpF]  (hidden comment: Cap)
C74  value 220pF  [220PpF]  (hidden comment: Cap)
C75  value 100uF  [Capacitor 100uF]  (hidden comment: Cap Pol2)
C76  value 100uF  [Capacitor 100uF]  (hidden comment: Cap Pol2)
C77  value 100pF  [Capacitor 100pF]  (hidden comment: Cap)
C78  value 100pF  [Capacitor 100pF]  (hidden comment: Cap)
C81  value 47uF  [Capacitor 47uF]  (hidden comment: Cap Pol2)
C82  value 47uF  [Capacitor 47uF]  (hidden comment: Cap Pol2)
C83  value 47uF  [Capacitor 47uF]  (hidden comment: Cap Pol2)
C84  value 47uF  [Capacitor 47uF]  (hidden comment: Cap Pol2)
D1  Diode 1N4007  [DO-41]  (value not drawn)
D2  Diode 1N4007  [DO-41]  (value not drawn)
D3  Diode 1N4007  [DO-41]  (value not drawn)
D4  Diode 1N4007  [DO-41]  (value not drawn)
D5  Diode 1N4007  [DO-41]  (value not drawn)
D6  Diode 1N4007  [DO-41]  (value not drawn)
D7  LED1  [LED]  (value not drawn)
D8  LED1  [LED]  (value not drawn)
D9  LED1  [LED]  (value not drawn)
D10  LED1  [LED]  (value not drawn)
D12  Diode 1N4007  [DO-41]  (value not drawn)
D13  Diode 1N4007  [DO-41]  (value not drawn)
D14  LED1  [LED]  (value not drawn)
D15  LED1  [LED]  (value not drawn)
D16  LED1  [LED]  (value not drawn)
D17  LED1  [LED]  (value not drawn)
F1  Fuse_case  [fluse_holder]
IC11  LM339N  [OPAMP_LM339]  (parts A,B,C,D of 4)
IC12  LM339N  [OPAMP_LM339]  (parts A,B,C,D of 4)
P9  value 47K  [trimmer]  (hidden comment: RPot)
P10  value 47K  [trimmer]  (hidden comment: RPot)
P11  value 47K  [trimmer]  (hidden comment: RPot)
P12  value 47K  [trimmer]  (hidden comment: RPot)
P14  value 47K  [trimmer]  (hidden comment: RPot)
P15  value 47K  [trimmer]  (hidden comment: RPot)
P16  value 47K  [trimmer]  (hidden comment: RPot)
P17  value 47K  [trimmer]  (hidden comment: RPot)
PIN1  trans_in  [header_2]
PIN2  trans_out  [transfo]
PIN_3  Header 3  [header_3]  (value not drawn)
PIN_4  Header 3  [header_3]  (value not drawn)
PIN_5  Header 3  [header_3]  (value not drawn)
PIN_6  Header 3  [header_3]  (value not drawn)
PIN_7  Header 3  [header_3]  (value not drawn)
PIN_8  Header 3  [header_3]  (value not drawn)
PIN_9  Header 3  [header_3]  (value not drawn)
R111  value 10  [C1206]  (hidden comment: Res2)
R112  value 100K  [C1206]  (hidden comment: Res2)
R113  value 27k  [C1206]  (hidden comment: Res2)
R114  value 470  [C1206]  (hidden comment: Res2)
R115  value 470  [C1206]  (hidden comment: Res2)
R116  value 470  [C1206]  (hidden comment: Res2)
R117  value 470  [C1206]  (hidden comment: Res2)
R118  value 10  [C1206]  (hidden comment: Res2)
R119  value 100K  [C1206]  (hidden comment: Res2)
R120  value 470  [C1206]  (hidden comment: Res2)
R121  value 470  [C1206]  (hidden comment: Res2)
R122  value 470  [C1206]  (hidden comment: Res2)
R123  value 470  [C1206]  (hidden comment: Res2)
R124  value 27k  [C1206]  (hidden comment: Res2)
S1  switch  [header_3]
U1  L7812ACV  [Volt_reg]  (value not drawn)
U2  L7912ACV  [Volt_reg]  (value not drawn)
  Plug AC Female  [header_3]

### Ports
L_ind (in), R_ind (in)

### Nets
GND: C71.2 C72.1 C73.1 C74.2 C75.2 C76.1 C77.1 C78.2 C82.2 C84.2 D6.1(A) D12.1(A) IC11.12(GND) IC12.12(GND) P9.2(BOT) P10.2(BOT) P11.2(BOT) P12.2(BOT) P14.2(BOT) P15.2(BOT) P16.2(BOT) P17.2(BOT) PIN2.1(3) PIN2.2 PIN_3.3(2) PIN_4.3(2) PIN_5.1(2) PIN_6.3(2) PIN_7.1(2) PIN_8.1(2) PIN_9.3(2) R113.2 R124.2 U1.2(GND) U2.2(GND)
GND_Chasie: .2(N)
VCC: C75.1 C77.2 D7.1(A) D8.1(A) D9.1(A) D10.1(A) D14.1(A) D15.1(A) D16.1(A) D17.1(A) IC11.3(V+) IC12.3(V+) P9.1(TOP) P10.1(TOP) P11.1(TOP) P12.1(TOP) P14.1(TOP) P15.1(TOP) P16.1(TOP) P17.1(TOP) PIN_3.2(1) PIN_4.2(1) PIN_5.2(1) PIN_6.2(1) PIN_7.2(1) PIN_8.2(1) PIN_9.2(1) U1.3(OUT)
VEE: C76.2 C78.1 PIN_3.1(3) PIN_4.1(3) PIN_5.3 PIN_6.1(3) PIN_7.3 PIN_8.3 PIN_9.1(3) U2.3(OUT)
NetC71_1: C71.1 C73.2 D2.2(K) D4.2(K) U1.1(IN)
NetC72_2: C72.2 C74.1 D1.1(A) D3.1(A) U2.1(IN)
NetC81_1: C81.1 D5.2(K) R112.1
NetC81_2: C81.2 C82.1 R111.2
NetC83_1: C83.1 D13.2(K) R119.1
NetC83_2: C83.2 C84.1 R118.2
NetD1_2: D1.2(K) D2.1(A) PIN2.4
NetD3_2: D3.2(K) D4.1(A) PIN2.3(1)
NetD5_1: D5.1(A) D6.2(K) R111.1 ; port R_ind
NetD7_2: D7.2(K) R114.1
NetD8_2: D8.2(K) R115.2
NetD9_2: D9.2(K) R116.2
NetD10_2: D10.2(K) R117.2
NetD12_2: D12.2(K) D13.1(A) R118.1 ; port L_ind
NetD14_2: D14.2(K) R120.1
NetD15_2: D15.2(K) R121.2
NetD16_2: D16.2(K) R122.2
NetD17_2: D17.2(K) R123.2
NetF1_1: F1.1 S1.2(OUT) S1.3(LED_out)
NetF1_2: F1.2 PIN1.1
NetIC11_1: IC11.1(OUT2) R115.1
NetIC11_2: IC11.2(OUT1) R114.2
NetIC11_4: IC11.4(IN1-) IC11.6(IN2-) IC11.8(IN3-) IC11.10(IN4-) R112.2 R113.1
NetIC11_5: IC11.5(IN1+) P9.3(TAP)
NetIC11_7: IC11.7(IN2+) P10.3(TAP)
NetIC11_9: IC11.9(IN3+) P11.3(TAP)
NetIC11_11: IC11.11(IN4+) P12.3(TAP)
NetIC11_13: IC11.13(OUT4) R117.1
NetIC11_14: IC11.14(OUT3) R116.1
NetIC12_1: IC12.1(OUT2) R121.1
NetIC12_2: IC12.2(OUT1) R120.2
NetIC12_4: IC12.4(IN1-) IC12.6(IN2-) IC12.8(IN3-) IC12.10(IN4-) R119.2 R124.1
NetIC12_5: IC12.5(IN1+) P14.3(TAP)
NetIC12_7: IC12.7(IN2+) P15.3(TAP)
NetIC12_9: IC12.9(IN3+) P16.3(TAP)
NetIC12_11: IC12.11(IN4+) P17.3(TAP)
NetIC12_13: IC12.13(OUT4) R123.1
NetIC12_14: IC12.14(OUT3) R122.1
NetPIN1_2: PIN1.2 .1(E)
NetS1_1: S1.1(IN) .3(L)

### Library data of the parts
C71 C72 C81-C84 = Cap Pol2: electrolytic; Published: 8-Jun-2000; LatestRevisionDate: 17-Jul-2002; LatestRevisionNote: Re-released for DXP Platform.; PackageReference: POLAR0.8; Publisher: Altium Limited; PackageDescription: Polarized Capacitor; 2 Leads
C73 C74 C77 C78 = Cap_3: Capacitor; Published: 8-Jun-2000; LatestRevisionDate: 17-Jul-2002; LatestRevisionNote: Re-released for DXP Platform.; PackageReference: RAD-0.3; Publisher: Altium Limited; PackageDescription: Radial Cap, Thru-Hole; 2 Leads; 0.3 in Pin Spacing
C75 C76 = Cap Pol2_2: Polarized Capacitor (Axial); Published: 8-Jun-2000; LatestRevisionDate: 17-Jul-2002; LatestRevisionNote: Re-released for DXP Platform.; PackageReference: POLAR0.8; Publisher: Altium Limited; PackageDescription: Polarized Capacitor; 2 Leads
D1-D6 D12 D13 = Diode 1N4007: 1 Amp General Purpose Rectifier; Published: 8-Jun-2000; LatestRevisionDate: 17-Jul-2002; LatestRevisionNote: Re-released for DXP Platform.; DatasheetVersion: 1998; PackageVersion: Aug-1999; PackageReference: DO-41; Publisher: Altium Limited; PackageDescription: Diode, Axial; Body 5.2 x 2.7 mm (LxDia. max), Lead Dia. 0.86 mm (max); Code_JEDEC: DO-204-AL; ComponentLink1Description: Manufacturer Link; ComponentLink1URL: http://www.fairchildsemi.com/; ComponentLink2Description: Datasheet; ComponentLink2URL: http://www.fairchildsemi.com/ds/1N%2F1N4001.pdf
D7-D10 D14-D17 = LED1: Typical RED GaAs LED; Published: 8-Jun-2000; LatestRevisionDate: 08-Jul-2005; LatestRevisionNote: Mech Layer 1 removed.; PackageReference: LED-1; Publisher: Altium Limited; PackageDescription: LED; 2 Leads
IC11 IC12 = opamp_LM339: Low Power Low Offset Voltage Quad Comparator, 14-pin MDIP; Manufacturer: Texas Instruments; CompType: Amplifiers; PackageTopMarking: NSUZXYYTTE#*LM339N; PowerWise: N; Code_JEDEC: MS-001-AA; ComponentLink1URL: http://www.ti.com/general/docs/lit/getliterature.tsp?genericPartNumber=LM339&fileType=pdf; Package Reference: N0014A; ComponentLink1Description: Datasheet URL; RoHS: N; PinCount: 14; PackageDescription: MDIP, .750 x .250 x.130in, 14 Lead, .100in Pitch
P9-P12 P14-P17 = RPot_1: as P5 on sheet xlr_ingang; Published: 8-Jun-2000; LatestRevisionDate: 17-Jul-2002; LatestRevisionNote: Re-released for DXP Platform.; PackageReference: VR5; Publisher: Altium Limited; PackageDescription: Variable Resistor, Thru-Hole; 3 Leads
PIN1 = MHDR1X2: Header, 2-Pin; LatestRevisionDate: 17-Jul-2002; LatestRevisionNote: Re-released for DXP Platform.; Publisher: Altium Limited
PIN2 = MHDR1X4: Header, 4-Pin; LatestRevisionDate: 17-Jul-2002; LatestRevisionNote: Re-released for DXP Platform.; Publisher: Altium Limited
PIN_3-PIN_9 = Header 3: Header, 3-Pin; LatestRevisionDate: 17-Jul-2002; LatestRevisionNote: Re-released for DXP Platform.; Publisher: Altium Limited
R111 R118 = Res2_2: Resistor; Published: 8-Jun-2000; LatestRevisionDate: 17-Jul-2002; LatestRevisionNote: Re-released for DXP Platform.; PackageReference: AXIAL-0.4; Publisher: Altium Limited; PackageDescription: Axial Device, Thru-Hole; 2 Leads; 0.4 in Pin Spacing
R112 R119 = Res2_5: Resistor; Published: 8-Jun-2000; LatestRevisionDate: 17-Jul-2002; LatestRevisionNote: Re-released for DXP Platform.; PackageReference: AXIAL-0.4; Publisher: Altium Limited; PackageDescription: Axial Device, Thru-Hole; 2 Leads; 0.4 in Pin Spacing
R113 R124 = Res2: Resistor; Published: 8-Jun-2000; LatestRevisionDate: 17-Jul-2002; LatestRevisionNote: Re-released for DXP Platform.; PackageReference: AXIAL-0.4; Publisher: Altium Limited; PackageDescription: Axial Device, Thru-Hole; 2 Leads; 0.4 in Pin Spacing
R114-R117 R120-R123 = Res2_13: Resistor; Published: 8-Jun-2000; LatestRevisionDate: 17-Jul-2002; LatestRevisionNote: Re-released for DXP Platform.; PackageReference: AXIAL-0.4; Publisher: Altium Limited; PackageDescription: Axial Device, Thru-Hole; 2 Leads; 0.4 in Pin Spacing
U1 = 7812: Positive Voltage Regulator, 12V, 3-Pin TO-220; PackageDescription: TO, Thru-Hole, Vertical, Heatsink Mounted; 3 In-Line Leads; Pitch 2.54 mm; ComponentLink3URL: http://www.st.com/internet/com/TECHNICAL_RESOURCES/TECHNICAL_LITERATURE/PACKAGE_INFORMATION/CD00004649.pdf; ComponentLink3Description: Package Specification; DatasheetVersion: 16/11/2011; ComponentLink1Description: Manufacturer URL; PackageVersion: ver3.0; PackageReference: TO220; ComponentLink1URL: http://www.st.com; ComponentLink2Description: Datasheet; ComponentLink2URL: http://www.st.com/internet/com/TECHNICAL_RESOURCES/TECHNICAL_LITERATURE/DATASHEET/CD00000444.pdf
U2 = 7912: 2% Negative Voltage Regulator, -12V, 3-Pin TO-220; ComponentLink2Description: Datasheet; PackageReference: TO220; ComponentLink1Description: Manufacturer URL; DatasheetVersion: 1/11/2010; ComponentLink2URL: http://www.st.com/internet/com/TECHNICAL_RESOURCES/TECHNICAL_LITERATURE/DATASHEET/CD00000451.pdf; PackageVersion: ver3.0; ComponentLink3Description: Package Specification; PackageDescription: TO, Thru-Hole, Vertical, Heatsink Mounted; 3 In-Line Leads; Pitch 2.54 mm; ComponentLink3URL: http://www.st.com/internet/com/TECHNICAL_RESOURCES/TECHNICAL_LITERATURE/PACKAGE_INFORMATION/CD00004649.pdf; ComponentLink1URL: http://www.st.com
 = Plug AC Female: IEC Mains Power Outlet, EN60 320-2-2 F Class I, PC Flange Rear Mount, Chassis Socket; PackageDocument: ver.80, 15-Sep-2003; MaximumRating: 10A, 250V a.c. (UL & CSA 15A, 250V a.c.); MountingFixtures: Not drawn on schematic symbol.; PCB_Layout: Complies with manufacturer's recommendation.; DrillSize: Corresponds to nominal value.

## Nets that join several sheets
GND: xlr_ingang (13 pins), cinch_stereo_ingang (14 pins), summing_circuit (23 pins), power_SUP (35 pins)
VCC: xlr_ingang (PIN_18.2 R15.2 R32.2), cinch_stereo_ingang (PIN_16.2 R68.2 R80.2), summing_circuit (8 pins), power_SUP (28 pins)
VEE: xlr_ingang (IC1.4 IC2.4 IC3.4 PIN_18.3), cinch_stereo_ingang (IC6.4 IC7.4 PIN_16.1), summing_circuit (6 pins), power_SUP (10 pins)
NetD5_1: summing_circuit (R102.2 XLR_male2.2), power_SUP (D5.1 D6.2 R111.1)
NetD12_2: summing_circuit (R57.2 XLR_male1.2), power_SUP (D12.2 D13.1 R118.1)